# Altium schematic sheet Reference_Voltage_2V048.SchDoc
size A4; SheetNumber: 4; SheetTotal: 4
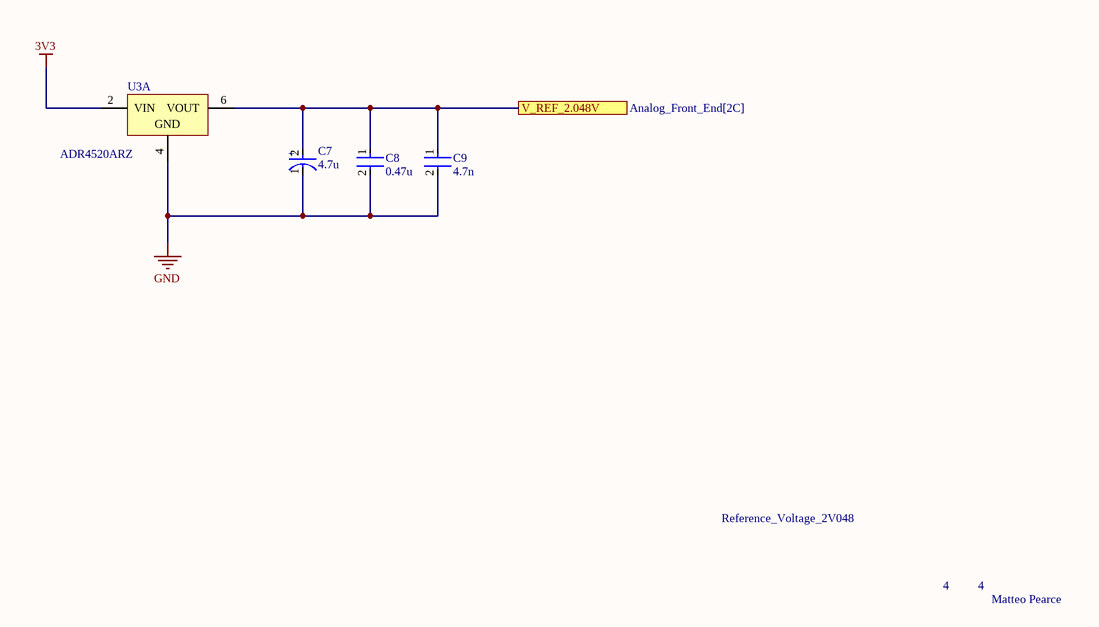
[diagram p0: Reference_Voltage_2V048.SchDoc]

## Parts
C7  4.7u  [FP-TAJA-MFG]
C8  0.47u  [FP-GCM188-0_1-IPC_A]
C9  4.7n  [FP-CC0805-0_85-MFG]
U3  ADR4520ARZ  [ADI-R-8_M]  (part A of 2)

## Ports
V_REF_2.048V (see Analog_Front_End[2C])

## Nets
3V3: U3.2(VIN)
GND: C7.1(C) C8.2 C9.2 U3.4(GND)
V_REF_2.048V: C7.2(A) C8.1 C9.1 U3.6(VOUT) ; port V_REF_2.048V

## Notes on the sheet
- Reference_Voltage_2V048
- 4
- Matteo Pearce
- (in symbol CMP-04424-000323-2) +

## Library data of the parts
C7 = CMP-04424-000323-2: 4.7uF 20V  ±10% 4Ω 1206  SMD Tantalum Capacitor; NexarPartId: 39985789; Q Factor: 6; Ripple Current: 137mA; Life (Hours): 2000hours; Dissipation Factor: 6%; Capacitance: 4.7µF; Leakage Current: 900nA; Polarity: Polar; Case Code (Imperial): 1206; Min Operating Temperature: -55°C; Length: 3.2mm; Lead Free: Lead Free; Width: 1.6mm; REACH SVHC: No SVHC; ESR (Equivalent Series Resistance): 4Ω; Lead Pitch: 1.1mm; RoHS: Compliant; Voltage Rating: 20V; Packaging: Cut Tape (CT); Height: 1.6mm; Dielectric Material: Tantalum; Voltage Rating (DC): 20V; Number of Pins: 2; Max Operating Temperature: 125°C; Height - Seated (Max): 1.8034mm; Schedule B: 8532210050; Lifecycle Status: Production; Depth: 1.6mm; Radiation Hardening: No; Case/Package: 1206; Features: General Purpose; Case Code (Metric): 3216; Tolerance: 10%; Termination: SMD/SMT; Voltage: 20V; Mount: PCB, Surface Mount
C8 = CMP-2006-02360-2: Ceramic Capacitor for Automotive 470nF  ±10% 16VDC X7R 0603 Paper T/R; Voltage: 16V; Max Operating Temperature: 125°C; Lead Free: Lead Free; Termination: SMD/SMT; Packaging: Tape and Reel; Width: 0.8mm; Mount: Surface Mount; Height: 0.8mm; Package Quantity: 1; Voltage Rating (DC): 16V; Length: 1.6mm; Dielectric: X7R; Case/Package: 0603; Voltage Rating: 16V; REACH SVHC: No SVHC; Thickness: 0.035inch; Min Operating Temperature: -55°C; Tolerance: 10%; Capacitance: 470nF; Depth: 0.8mm; Radiation Hardening: No; Case Code (Metric): 1608; Case Code (Imperial): 0603; Ratings: AEC-Q200
C9 = CMP-03422-000052-1: CAP CER 0.047UF 50V X7R 0805; Manufacturer Part Number: CC0805KRX7R9BB473; Manufacturer: Yageo; Description: CC0805 47 nF X7R 10.00% 50 V; Value: 47 nF; Tolerance: 0.1; Material: Ceramic; Footprint Url: http://www.yageo.com/exep/pages/download/literatures/UPY-C_GEN_24.pdf; ComponentLink2URL: http://www.yageo.com/documents/recent/UPY-GPHC_Y5V_6.3V-to-50V_8.pdf; Ipc Land Pattern Name: CAPC200125X85; Digikey Description: CAP CER 0.047UF 50V X7R 0805; Lead Free: Yes; Octopart: https://octopart.com/cc0805krx7r9bb473-yageo-42181304; Voltage Rating: 50 V; RoHS: TRUE; ComponentLink2Description: Datasheet; Temperature Range High: +85°C; Package: CC0805-0.85; Temperature Range Low: -30°C; Device Class L2: Capacitors; Device Class L3: Ceramic Capacitors; Height: 0.95mm; Temperature: -30°C to +85°C; Category: Cap; Device Class L1: Passive Components; Capacitance: 47 nF; Temperature Characteristic: X7R; Automotive: No; Mouser Description: Multilayer Ceramic Capacitors MLCC - SMD/SMT 47nF 50V X7R 10%
U3 = CMP-0784-00292-1: Ultralow Noise, High Accuracy Voltage Reference, 2.048 V Output, 3 to 15 V Supply, Industrial, 8-pin SOIC (R-8), Tube; Manufacturer: Analog Devices; Min V Supply (V): 3; Max V Supply (V): 15; Ref Out TC (ppm/C): 4; Vout: 2.048V; ComponentLink2Description: Datasheet; ComponentLink2URL: http://www.analog.com/static/imported-files/data_sheets/ADR4520_4525_4530_4533_4540_4550.pdf; PartNumber: ADR4520ARZ; ComponentLink4URL: Product URL:http://www.analog.com/en/special-linear-functions/voltage-references/adr4520/products/product.html; Packing: Tube; Code_JEDEC: MS-012-AA; Operating Temp Range: -40 to 125 degC; ComponentLink1Description: Manufacturer URL; PackageVersion: 060506-A, 06/2006; ComponentLink3URL: http://www.analog.com/static/imported-files/packages/PKG_PDF/SOIC_Narrow%20(R)/R_8.pdf; ComponentLink1URL: http://www.analog.com/en/index.html; DatasheetVersion: Rev. 0; ComponentLink3Description: Package Specification; PackageReference: R-8; Mounting Technology: Surface Mount; PackageDescription: 8-Pin Standard Small Outline Package, Body 4.9 x 3.9 mm, Pitch 1.27 mm; ComponentLink4Description: URL Link1